# Altium schematic sheet Sheet1.SCHDOC
size 594 x 420 mm; SheetNumber: 1; SheetTotal: 1; Scale: 1:1; DocumentType: Схема электрическая принципиальная; FirstReferrence: АБВГ.123456.001; DocumentName: Sheet1.SCHDOC
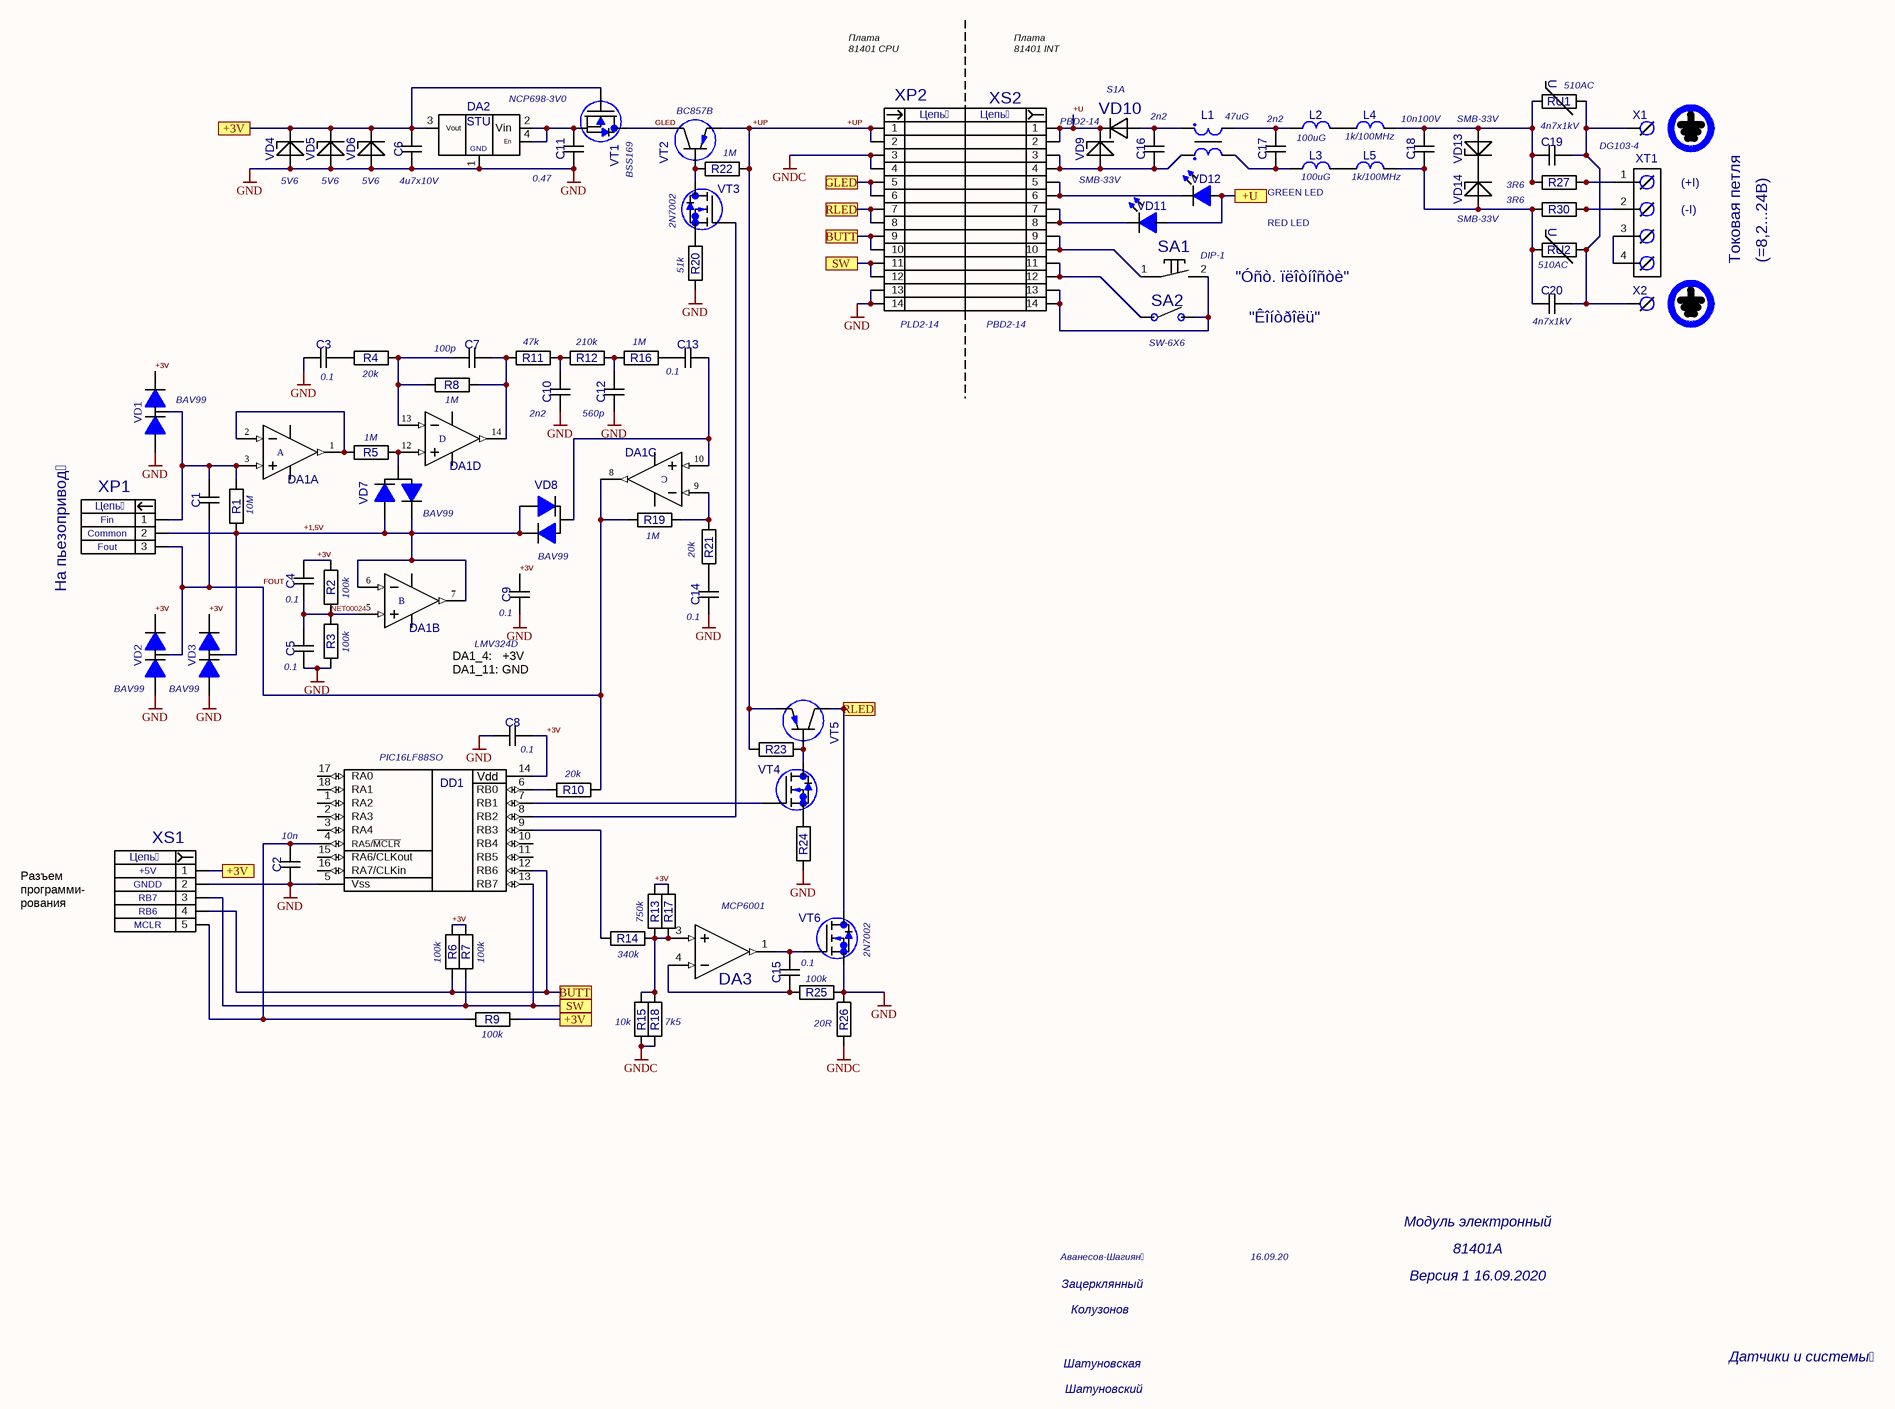
[diagram p0: Sheet1.SCHDOC]

## Parts
C1  CN0805  [0805]  (value not drawn)
C2  CN0805  [0805]  (value not drawn)
C3  CN0805  [0805]  (value not drawn)
C4  CN0805  [0805]  (value not drawn)
C5  CN0805  [0805]  (value not drawn)
C6  CN0805  [0805]  (value not drawn)
C7  CN0805  [0805]  (value not drawn)
C8  CN0805  [0805]  (value not drawn)
C9  CN0805  [0805]  (value not drawn)
C10  CN0805  [0805]  (value not drawn)
C11  CN0805  [0805]  (value not drawn)
C12  CN0805  [0805]  (value not drawn)
C13  CN0805  [0805]  (value not drawn)
C14  CN0805  [0805]  (value not drawn)
C15  CN0805  [0805]  (value not drawn)
C16  CN0805  [0805]  (value not drawn)
C17  CN0805  [0805]  (value not drawn)
C18  CN0805  [0805]  (value not drawn)
C19  CN1210  [1210]  (value not drawn)
C20  CN1210  [1210]  (value not drawn)
DA1  DA-OP-AD8544-SO14  [SO-G14]  (value not drawn)  (parts A,B,C,D of 4)
DA2  DA-STU-NCP698  [SC-82AB]  (value not drawn)
DA3  DA-OP-AD8541-SOT23  [SOT23-(5)]  (value not drawn)
DD1  DD-CPU-PIC16F88SO  [SO18W]  (value not drawn)
L1  L-SF0602  [SF0602]  (value not drawn)
L2  L-1210  [1210]  (value not drawn)
L3  L-1210  [1210]  (value not drawn)
L4  L-0805  [0805]  (value not drawn)
L5  L-0805  [0805]  (value not drawn)
R1  R1206  [1206]  (value not drawn)
R2  R1206  [1206]  (value not drawn)
R3  R1206  [1206]  (value not drawn)
R4  R1206  [1206]  (value not drawn)
R5  R1206  [1206]  (value not drawn)
R6  R1206  [1206]  (value not drawn)
R7  R1206  [1206]  (value not drawn)
R8  R1206  [1206]  (value not drawn)
R9  R1206  [1206]  (value not drawn)
R10  R1206  [1206]  (value not drawn)
R11  R1206  [1206]  (value not drawn)
R12  R1206  [1206]  (value not drawn)
R13  R1206  [1206]  (value not drawn)
R14  R1206  [1206]  (value not drawn)
R15  R1206  [1206]  (value not drawn)
R16  R1206  [1206]  (value not drawn)
R17  R1206  [1206]  (value not drawn)
R18  R1206  [1206]  (value not drawn)
R19  R1206  [1206]  (value not drawn)
R20  R1206  [1206]  (value not drawn)
R21  R1206  [1206]  (value not drawn)
R22  R1206  [1206]  (value not drawn)
R23  R1206  [1206]  (value not drawn)
R24  R1206  [1206]  (value not drawn)
R25  R1206  [1206]  (value not drawn)
R26  R1206  [1206]  (value not drawn)
R27  R2512  [2512]  (value not drawn)
R28  R1206  [1206]  (value not drawn)
R29  R1206  [1206]  (value not drawn)
R30  R2512  [2512]  (value not drawn)
RU1  RU-14D  [RU-14D]  (value not drawn)
RU2  RU-14D  [RU-14D]  (value not drawn)
SA1  SA-1DIP  [DIP2]  (value not drawn)
SA2  SA-TACTSW-6X6  [TS_6X6]  (value not drawn)
VD1  VD-DIOD-BAV99V  [SOT23]  (value not drawn)
VD2  VD-DIOD-BAV99V  [SOT23]  (value not drawn)
VD3  VD-DIOD-BAV99V  [SOT23]  (value not drawn)
VD4  VD-BZ-DO213AA  [DO-213AA]  (value not drawn)
VD5  VD-BZ-DO213AA  [DO-213AA]  (value not drawn)
VD6  VD-BZ-DO213AA  [DO-213AA]  (value not drawn)
VD7  VD-DIOD-BAV99  [SOT23]  (value not drawn)
VD8  VD-DIOD-BAV99  [SOT23]  (value not drawn)
VD9  VD-BZ-DO214AA  [DO-214AA]  (value not drawn)
VD10  VD-DIOD-DO214AC  [DO-214AC]  (value not drawn)
VD11  VD-LED-3MM  [LED300]  (value not drawn)
VD12  VD-LED-3MM  [LED300]  (value not drawn)
VD13  VD-BZ-DO214AA  [DO-214AA]  (value not drawn)
VD14  VD-BZ-DO214AA  [DO-214AA]  (value not drawn)
VT1  VT-JFET_N-SOT23-BSS169  [SOT23]  (value not drawn)
VT2  VT-PNP_SOT23  [SOT23]  (value not drawn)
VT3  VT-MOSFET_N-SOT23  [SOT23]  (value not drawn)
VT4  VT-MOSFET_N-SOT23  [SOT23]  (value not drawn)
VT5  VT-PNP_SOT23  [SOT23]  (value not drawn)
VT6  VT-MOSFET_N-SOT23  [SOT23]  (value not drawn)
X1  X-BUSH_CONT_450  [BUSH_CONT_450]  (value not drawn)
X2  X-BUSH_CONT_450  [BUSH_CONT_450]  (value not drawn)
XP1  XP-3-PLS2  [PLS2-3]  (value not drawn)
XP2  XP-14-PLD2  [PLD2-14]  (value not drawn)
XS1  XS-5-PBS2  [PBS2-5]  (value not drawn)
XS2  value PBD2-14  [PBD2-14]  (hidden comment: XS-14-PBD2)
XT1  XT-4-330  [XT-4-330]  (value not drawn)

## Ports
+3V, +U, BUTT, GLED, RLED, SW

## Nets
+3V: C4.1 C8.1 C9.1 DA1.4(V+) DA3.5(V+) DD1.14(Vdd) R2.2 R6.2 R7.2 R13.1 R17.1 VD1.2(K) VD2.2(K) VD3.2(K)
GND: C2.2 C3.2 C5.2 C6.2 C8.2 C9.2 C10.2 C11.2 C12.2 C14.2 DA1.11(V-) DA2.1(GND) DA3.2(V-) DD1.5(Vss) R3.1 R20.2 R24.2 R25.1 R26.1 VD1.1(A) VD2.1(A) VD3.1(A) VD4.1(A) VD5.1(A) VD6.1(A) VT6.2(Source) XP2.13 XP2.14 XS1.2
GNDC: R15.2 R18.2 R26.2 XP2.3 XP2.4
+1,5V: DA1.6(IN-) DA1.7(OUT) R1.1 VD3.3(K/A) VD7.1(A) VD7.2(K) VD8.1(A) VD8.2(K) XP1.2
+3V: C6.1 DA2.3(Vout) R9.1 VD4.2(K) VD5.2(K) VD6.2(K) VT1.1(Gate) XS1.1 ; port +3V  [a separate net that carries the same name]
+U: VD9.2(K) VD10.2(K) XS2.1 XS2.2
+U: VD11.1(A) VD12.1(A) ; port +U  [a separate net that carries the same name]
+UP: R22.1 R23.1 VT2.2(k) VT5.2(k) XP2.1 XP2.2
BUTT: DD1.12(RB6) R6.1 XP2.9 XP2.10 XS1.4 ; port BUTT
FOUT: C1.2 DA1.8(OUT) R10.2 R19.2 VD2.3(K/A) XP1.3
GLED: VT1.3(Drain) VT2.3(b)
GLED: XP2.5 XP2.6 ; port GLED  [a separate net that carries the same name]
NET00024: C4.2 C5.1 DA1.5(IN+) R2.1 R3.2
RLED: VT5.3(b) VT6.3(drain) XP2.7 XP2.8 ; port RLED
SW: DD1.13(RB7) R7.1 XP2.11 XP2.12 XS1.3 ; port SW
NetC1_1: C1.1 DA1.3(IN+) R1.2 VD1.3(K/A) XP1.1
NetC2_1: C2.1 DD1.4(RA5/~{MCLR}) R9.2 XS1.5
NetC3_1: C3.1 R4.2
NetC7_1: C7.1 DA1.14(OUT) R8.1 R11.2
NetC7_2: C7.2 DA1.13(IN-) R4.1 R8.2
NetC10_1: C10.1 R11.1 R12.2
NetC11_1: C11.1 DA2.2(Vin) DA2.4(En) VT1.2(Source)
NetC12_1: C12.1 R12.1 R16.2
NetC13_1: C13.1 DA1.10(IN+) VD8.3(K/A)
NetC13_2: C13.2 R16.1
NetC14_1: C14.1 R21.2
NetC15_1: C15.1 DA3.1(out) VT6.1(Gait)
NetC15_2: C15.2 DA3.4(-in) R25.2
NetC16_1: C16.1 L1.1 VD10.1(A)
NetC16_2: C16.2 L1.2 VD9.1(A) XS2.3 XS2.4
NetC17_1: C17.1 L1.4 L2.1
NetC17_2: C17.2 L1.3 L3.1
NetC18_1: C18.1 C19.2 L4.2 R27.1 R28.1 RU1.2 VD13.1(A)
NetC18_2: C18.2 C20.2 L5.2 R29.1 R30.1 RU2.2 VD14.1(A)
NetC19_1: C19.1 C20.1 RU1.1 RU2.1 X1.1 X2.1
NetDA1_1: DA1.1(OUT) DA1.2(IN-) R5.2
NetDA1_9: DA1.9(IN-) R19.1 R21.1
NetDA1_12: DA1.12(IN+) R5.1 VD7.3(K/A)
NetDA3_3: DA3.3(+in) R13.2 R14.1 R15.1 R17.2 R18.1
NetDD1_6: DD1.6(RB0) R10.1
NetDD1_7: DD1.7(RB1) VT4.1(Gait)
NetDD1_8: DD1.8(RB2) VT3.1(Gait)
NetDD1_9: DD1.9(RB3) R14.2
NetL2_2: L2.2 L4.1
NetL3_2: L3.2 L5.1
NetR20_1: R20.1 VT3.2(Source)
NetR22_2: R22.2 VT2.1(e) VT3.3(drain)
NetR23_2: R23.2 VT4.3(drain) VT5.1(e)
NetR24_1: R24.1 VT4.2(Source)
NetR27_2: R27.2 R28.2 XT1.1(Contact1)
NetR29_2: R29.2 R30.2 XT1.2(Contact2)
NetSA1_1: SA1.1 XS2.9 XS2.10
NetSA1_2: SA1.2 SA2.1 XS2.13 XS2.14
NetSA2_2: SA2.2 XS2.11 XS2.12
NetVD11_2: VD11.2(K) XS2.7 XS2.8
NetVD12_2: VD12.2(K) XS2.5 XS2.6
NetVD13_2: VD13.2(K) VD14.2(K)
NetXT1_3: XT1.3(Contact3) XT1.4(Contact4)

Not connected (* = marked no-connect by the designer): DD1 1(RA2) 2(RA3) 3(RA4) 10(RB4) 11(RB5) 15(RA6/CLKout) 16(RA7/CLKin) 17(RA0) 18(RA1); SA2 3 4

## Notes on the sheet
- NCP698-3V0
- Плата
  81401 CPU
- Плата
  81401 INT
- S1А
- (near RU1) 510AC
- (near VT1) BSS169
- (near VT2) BC857B
- 1M
- 2n2
- (near L1) 47uG
- (near L2) 100uG
- (near L4) 1k/100MHz
- 10n100V
- (near VD13) SMB-33V
- 4n7x1kV
- (near X1) DG103-4
- (near VD4) 5V6
- (near VD5) 5V6
- (near VD6) 5V6
- 4u7x10V
- 0.47
- 2N7002
- (near VD9) SMB-33V
- RED LED
- (near L3) GREEN LED
- (near L3) 100uG
- (near L5) 1k/100MHz
- (near VD14) SMB-33V
- 3R6
- (near XT1) (-I)
- (+I)
- Токовая петля
- (near R20) 51k
- (near SA1) DIP-1
- "Óñò. ïëîòíîñòè"
- (near RU2) 510AC
- (=8,2...24В)
- 0.1
- (near R4) 20k
- (near C7) 100p
- (near R11) 47k
- (near R12) 210k
- (near R16) 1M
- (near XP2) PLD2-14
- (near XS2) PBD2-14
- (near SA2) SW-6X6
- "Êîíòðîëü"
- (near C20) 4n7x1kV
- (near VD1) BAV99
- (near R5) 1M
- (near R8) 1M
- (near C10) 2n2
- (near C12) 560p
- (near R1) 10M
- (near VD7) BAV99
- На пьезопривод
- (near XP1) Fout
- (near XP1) Common
- (near XP1) Fin
- (near VD8) BAV99
- (near R19) 1M
- (near R21) 20k
- (near C4) 0.1
- (near R3) 100k
- (near R2) 100k
- LMV324D
- (near C9) 0.1
- (near C14) 0.1
- (near VD2) BAV99
- BAV99
- (near C5) 0.1
- DA1_4:   +3V
  DA1_11: GND
- (near DD1) PIC16LF88SO
- (near C8) 0.1
- (near R10) 20k
- (near C2) 10n
- (near XS1) +5V
- (near XS1) RB7
- (near XS1) RB6
- (near XS1) GNDD
- 750k
- (near DA3) MCP6001
- Разъем
  программи-
  рования
- (near XS1) MCLR
- (near R6) 100k
- (near R7) 100k
- (near R14) 340k
- (near R25) 100k
- (near VT6) 2N7002
- (near R9) 100k
- (near R15) 10k
- (near R18) 7k5
- (near R26) 20R
- 81401A
- Модуль электронный
- Колузонов
- Зацерклянный
- Аванесов-Шагиян
- 16.09.20
- Версия 1 16.09.2020
- Шатуновская
- Шатуновский
- Датчики и системы
- Перв. примен.
- Справ. №
- Подп. и дата
- Инв. № дубл.
- Взам. инв. №
- Разраб.
- Изм.
- Лист
- № докум.
- Подп.
- Дата
- Лит.
- Масса
- Масштаб
- Пров.
- Т.контр.
- Листов
- Инв. № подл.
- Утв.
- Н.контр.
- 2.106-A3
- Копировал
- Формат А3
- (in symbol DA-OP-AD8544-SO14, part A) A
- (in symbol DA-OP-AD8544-SO14, part B) B
- (in symbol DA-OP-AD8544-SO14, part C) C
- (in symbol DA-OP-AD8544-SO14, part D) D
- (in symbol DA-STU-NCP698) STU
- (in symbol RU-14D) U
- (in symbol XP-3-PLS2) Цепь
- (in symbol XP-14-PLD2) Цепь
- (in symbol XS-5-PBS2) Цепь
- (in symbol XS-14-PBD2) Цепь

## Library data of the parts
C2 = CN0805: Value: 10n
C3-C5 C8 C9 C13-C15 = CN0805: Value: 0.1
C6 = CN0805: Value: 4u7x10V
C7 = CN0805: Value: 100p
C10 C16 C17 = CN0805: Value: 2n2
C11 = CN0805: Value: 0.47
C12 = CN0805: Value: 560p
C18 = CN0805: Value: 10n100V
C19 C20 = CN1210: Value: 4n7x1kV
DA1 = DA-OP-AD8544-SO14: Micropower Single-Supply Rail-to-Rail Input/Output Operational Amplifier; Value: LMV324D; OriginalName: OP491GS; ComponentField6: Published 8-Jun-2000
DA2 = DA-STU-NCP698: Value: NCP698-3V0
DA3 = DA-OP-AD8541-SOT23: Value: MCP6001; OriginalName: AD8531AR; ComponentField7: Published 8-Jun-2000, Modified 10-July-2000: SIM Model Added.; ComponentField6: Pin 8 is not connected. Parameters RG and RB are not available in SPICE. As a result simulation generates an error, however output correct.
L1 = L-SF0602: Value: 47uG
L2 L3 = L-1210: Value: 100uG
L4 L5 = L-0805: Value: 1k/100MHz
R1 = R1206: Value: 10M
R2 R3 R6 R7 R9 R25 = R1206: Value: 100k
R4 R10 R21 = R1206: Value: 20k
R5 R8 R16 R19 R22 R23 = R1206: Value: 1M
R11 = R1206: Value: 47k
R12 = R1206: Value: 210k
R13 = R1206: Value: 750k
R14 = R1206: Value: 340k
R15 = R1206: Value: 10k
R18 = R1206: Value: 7k5
R20 R24 = R1206: Value: 51k
R26 = R1206: Value: 20R
R27 R30 = R2512: Value: 3R6
RU1 RU2 = RU-14D: Value: 510AC
VD2 VD3 = VD-DIOD-BAV99V: Value: BAV99
VD4-VD6 = VD-BZ-DO213AA: Value: 5V6
VD7 VD8 = VD-DIOD-BAV99: Value: BAV99
VD9 VD14 = VD-BZ-DO214AA: Value: 33V
VD10 = VD-DIOD-DO214AC: Value: S1А
VD11 = VD-LED-3MM: Value: LED-3MM-Red
VD12 = VD-LED-3MM: Value: LED-3MM-Green
VD13 = VD-BZ-DO214AA: Value: SMB-33V
VT1 = VT-JFET_N-SOT23-BSS169: Value: BSS169
VT2 = VT-PNP_SOT23: Value: BC857B
VT3 VT6 = VT-MOSFET_N-SOT23: Value: 2N7002
XT1 = XT-4-330: Value: DG103-4
DD1 = DD-CPU-PIC16F88SO: Value: *
SA1 = SA-1DIP: Value: *
SA2 = SA-TACTSW-6X6: Value: *
X1 X2 = X-BUSH_CONT_450: Value: *
XP1 = XP-3-PLS2: Value: *
XP2 = XP-14-PLD2: Value: *
XS1 = XS-5-PBS2: Value: *